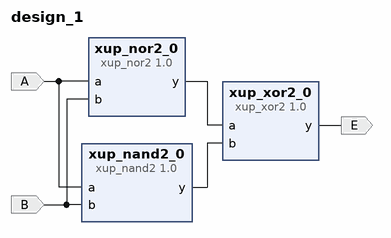
[diagram p0: block diagram of the top level]
# Vivado block design design_1, xc7vx485tffg1157-1, Vivado 2020.1
create_bd_design design_1

create_bd_port -dir I A
create_bd_port -dir I B
create_bd_port -dir O E

create_bd_cell -type ip -vlnv xilinx.com:XUP:xup_nor2:1.0 xup_nor2_0
create_bd_cell -type ip -vlnv xilinx.com:XUP:xup_nand2:1.0 xup_nand2_0
create_bd_cell -type ip -vlnv xilinx.com:XUP:xup_xor2:1.0 xup_xor2_0

# ---- connections ----

connect_bd_net [get_bd_ports A] [get_bd_pins xup_nor2_0/a] [get_bd_pins xup_nand2_0/a]
connect_bd_net [get_bd_ports B] [get_bd_pins xup_nor2_0/b] [get_bd_pins xup_nand2_0/b]
connect_bd_net [get_bd_pins xup_nor2_0/y] [get_bd_pins xup_xor2_0/a]
connect_bd_net [get_bd_pins xup_nand2_0/y] [get_bd_pins xup_xor2_0/b]
connect_bd_net [get_bd_pins xup_xor2_0/y] [get_bd_ports E]

validate_bd_design
save_bd_design
